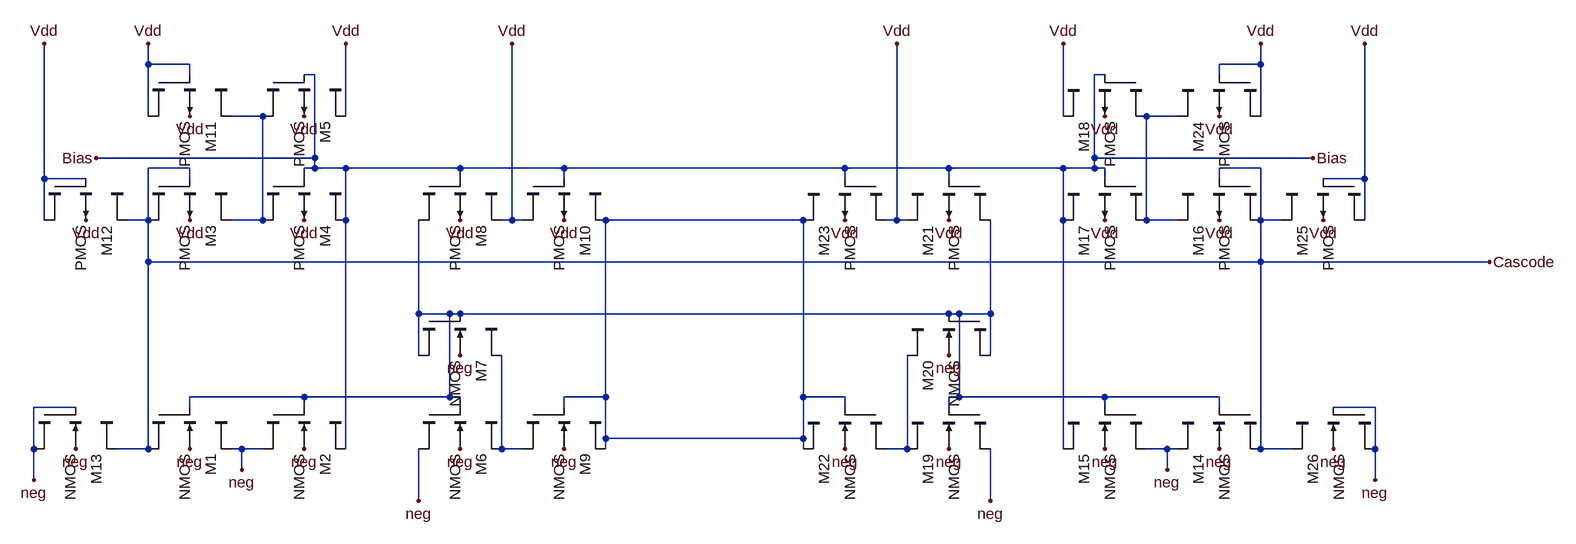
[diagram p0: schematic doublebiasLVS.asc]
doublebiasLVS.asc, the LTspice schematic file:
Version 4
SHEET 1 2224 680
WIRE 32 -272 32 -304
WIRE 96 -272 32 -272
WIRE 1744 -272 1744 -304
WIRE 1744 -272 1680 -272
WIRE 96 -256 96 -272
WIRE 288 -256 272 -256
WIRE 1504 -256 1488 -256
WIRE 1680 -256 1680 -272
WIRE 32 -192 32 -272
WIRE 208 -192 160 -192
WIRE 336 -192 336 -304
WIRE 1440 -192 1440 -304
WIRE 1616 -192 1568 -192
WIRE 1744 -192 1744 -272
WIRE 288 -128 288 -256
WIRE 288 -128 -48 -128
WIRE 1488 -128 1488 -256
WIRE 1824 -128 1488 -128
WIRE 96 -112 32 -112
WIRE 288 -112 288 -128
WIRE 288 -112 272 -112
WIRE 336 -112 288 -112
WIRE 512 -112 336 -112
WIRE 672 -112 512 -112
WIRE 1104 -112 672 -112
WIRE 1264 -112 1104 -112
WIRE 1440 -112 1264 -112
WIRE 1488 -112 1488 -128
WIRE 1488 -112 1440 -112
WIRE 1504 -112 1488 -112
WIRE 1744 -112 1680 -112
WIRE -128 -96 -128 -304
WIRE -64 -96 -128 -96
WIRE 96 -96 96 -112
WIRE 272 -96 272 -112
WIRE 512 -96 512 -112
WIRE 672 -96 672 -112
WIRE 1104 -96 1104 -112
WIRE 1264 -96 1264 -112
WIRE 1504 -96 1504 -112
WIRE 1680 -96 1680 -112
WIRE 1904 -96 1904 -304
WIRE 1904 -96 1840 -96
WIRE -128 -32 -128 -96
WIRE 32 -32 32 -112
WIRE 32 -32 0 -32
WIRE 208 -32 208 -192
WIRE 208 -32 160 -32
WIRE 336 -32 336 -112
WIRE 592 -32 592 -304
WIRE 592 -32 576 -32
WIRE 608 -32 592 -32
WIRE 1040 -32 736 -32
WIRE 1184 -32 1184 -304
WIRE 1184 -32 1168 -32
WIRE 1200 -32 1184 -32
WIRE 1440 -32 1440 -112
WIRE 1568 -32 1568 -192
WIRE 1616 -32 1568 -32
WIRE 1744 -32 1744 -112
WIRE 1776 -32 1744 -32
WIRE 1904 -32 1904 -96
WIRE 32 32 32 -32
WIRE 1744 32 1744 -32
WIRE 1744 32 32 32
WIRE 2096 32 1744 32
WIRE 448 112 448 -32
WIRE 496 112 448 112
WIRE 512 112 496 112
WIRE 1264 112 512 112
WIRE 1280 112 1264 112
WIRE 1328 112 1328 -32
WIRE 1328 112 1280 112
WIRE 448 176 448 112
WIRE 1328 176 1328 112
WIRE 272 240 96 240
WIRE 496 240 496 112
WIRE 496 240 272 240
WIRE 512 240 496 240
WIRE 736 240 736 -32
WIRE 736 240 672 240
WIRE 1040 240 1040 -32
WIRE 1104 240 1040 240
WIRE 1280 240 1280 112
WIRE 1280 240 1264 240
WIRE 1504 240 1280 240
WIRE 1680 240 1504 240
WIRE -80 256 -144 256
WIRE 96 256 96 240
WIRE 272 256 272 240
WIRE 512 256 512 240
WIRE 672 256 672 240
WIRE 1104 256 1104 240
WIRE 1264 256 1264 240
WIRE 1504 256 1504 240
WIRE 1680 256 1680 240
WIRE 1920 256 1856 256
WIRE 736 304 736 240
WIRE 1040 304 1040 240
WIRE 1040 304 736 304
WIRE -144 320 -144 256
WIRE 32 320 32 32
WIRE 32 320 -16 320
WIRE 176 320 160 320
WIRE 208 320 176 320
WIRE 336 320 336 -32
WIRE 576 320 576 176
WIRE 608 320 576 320
WIRE 736 320 736 304
WIRE 1040 320 1040 304
WIRE 1200 320 1200 176
WIRE 1200 320 1168 320
WIRE 1440 320 1440 -32
WIRE 1600 320 1568 320
WIRE 1616 320 1600 320
WIRE 1744 320 1744 32
WIRE 1792 320 1744 320
WIRE 1920 320 1920 256
WIRE 176 352 176 320
WIRE 1600 352 1600 320
WIRE -144 368 -144 320
WIRE 1920 368 1920 320
WIRE 448 400 448 320
WIRE 1328 400 1328 320
FLAG 96 -32 Vdd
FLAG 272 -32 Vdd
FLAG 272 -192 Vdd
FLAG 336 -304 Vdd
FLAG 512 -32 Vdd
FLAG 672 -32 Vdd
FLAG 592 -304 Vdd
FLAG -48 -128 Bias
FLAG 96 -192 Vdd
FLAG 32 -304 Vdd
FLAG -128 -304 Vdd
FLAG -64 -32 Vdd
FLAG 1680 -32 Vdd
FLAG 1504 -32 Vdd
FLAG 1504 -192 Vdd
FLAG 1440 -304 Vdd
FLAG 1264 -32 Vdd
FLAG 1104 -32 Vdd
FLAG 1184 -304 Vdd
FLAG 1824 -128 Bias
FLAG 1680 -192 Vdd
FLAG 1744 -304 Vdd
FLAG 1904 -304 Vdd
FLAG 1840 -32 Vdd
FLAG 2096 32 Cascode
FLAG 1920 368 neg
FLAG 1856 320 neg
FLAG 1680 320 neg
FLAG 1600 352 neg
FLAG 1504 320 neg
FLAG 1328 400 neg
FLAG 1264 320 neg
FLAG 1104 320 neg
FLAG 672 320 neg
FLAG 512 320 neg
FLAG 448 400 neg
FLAG 272 320 neg
FLAG 176 352 neg
FLAG 96 320 neg
FLAG -80 320 neg
FLAG -144 368 neg
FLAG 512 176 neg
FLAG 1264 176 neg
SYMBOL cktsym\\nmos4 96 320 R90
SYMATTR InstName M1
SYMATTR Value2 l=3.9u w=2.1u
SYMBOL cktsym\\nmos4 272 320 R90
SYMATTR InstName M2
SYMATTR Value2 l=8.1u w=.9u
SYMBOL cktsym\\pmos4 96 -32 R90
SYMATTR InstName M3
SYMATTR Value2 l=3.9u w=8.1u
SYMBOL cktsym\\pmos4 272 -32 R90
SYMATTR InstName M4
SYMATTR Value2 l=.9u w=8.1u
SYMBOL cktsym\\pmos4 272 -192 R90
SYMATTR InstName M5
SYMATTR Value2 l=3.9u w=8.1u
SYMBOL cktsym\\nmos4 512 320 R90
SYMATTR InstName M6
SYMATTR Value2 l=3.9u w=2.1u
SYMBOL cktsym\\nmos4 512 176 R90
SYMATTR InstName M7
SYMATTR Value2 l=3.9u w=8.1u
SYMBOL cktsym\\pmos4 512 -32 R90
SYMATTR InstName M8
SYMATTR Value2 l=3.9u w=1.8u
SYMBOL cktsym\\nmos4 672 320 R90
SYMATTR InstName M9
SYMATTR Value2 l=3.9u w=2.1u
SYMBOL cktsym\\pmos4 672 -32 R90
SYMATTR InstName M10
SYMATTR Value2 l=3.9u w=8.1u
SYMBOL cktsym\\pmos4 96 -192 R90
SYMATTR InstName M11
SYMATTR Value2 l=3.9u w=8.1u
SYMBOL cktsym\\pmos4 -64 -32 R90
SYMATTR InstName M12
SYMATTR Value2 l=3.9u w=8.1u
SYMBOL cktsym\\nmos4 -80 320 R90
SYMATTR InstName M13
SYMATTR Value2 l=3.9u w=2.1u
SYMBOL cktsym\\nmos4 1680 320 M90
SYMATTR InstName M14
SYMATTR Value2 l=3.9u w=2.1u
SYMBOL cktsym\\nmos4 1504 320 M90
SYMATTR InstName M15
SYMATTR Value2 l=8.1u w=.9u
SYMBOL cktsym\\pmos4 1680 -32 M90
SYMATTR InstName M16
SYMATTR Value2 l=3.9u w=8.1u
SYMBOL cktsym\\pmos4 1504 -32 M90
SYMATTR InstName M17
SYMATTR Value2 l=.9u w=8.1u
SYMBOL cktsym\\pmos4 1504 -192 M90
SYMATTR InstName M18
SYMATTR Value2 l=3.9u w=8.1u
SYMBOL cktsym\\nmos4 1264 320 M90
SYMATTR InstName M19
SYMATTR Value2 l=3.9u w=2.1u
SYMBOL cktsym\\nmos4 1264 176 M90
SYMATTR InstName M20
SYMATTR Value2 l=3.9u w=8.1u
SYMBOL cktsym\\pmos4 1264 -32 M90
SYMATTR InstName M21
SYMATTR Value2 l=3.9u w=1.8u
SYMBOL cktsym\\nmos4 1104 320 M90
SYMATTR InstName M22
SYMATTR Value2 l=3.9u w=2.1u
SYMBOL cktsym\\pmos4 1104 -32 M90
SYMATTR InstName M23
SYMATTR Value2 l=3.9u w=8.1u
SYMBOL cktsym\\pmos4 1680 -192 M90
SYMATTR InstName M24
SYMATTR Value2 l=3.9u w=8.1u
SYMBOL cktsym\\pmos4 1840 -32 M90
SYMATTR InstName M25
SYMATTR Value2 l=3.9u w=8.1u
SYMBOL cktsym\\nmos4 1856 320 M90
SYMATTR InstName M26
SYMATTR Value2 l=3.9u w=2.1u

The netlist it stands for:
* doublebiasLVS.asc
M1 neg N004 Cascode neg NMOS l=3.9u w=2.1u
M2 Bias N004 neg neg NMOS l=8.1u w=.9u
M3 Cascode Cascode N001 Vdd PMOS l=3.9u w=8.1u
M4 N001 Bias Bias Vdd PMOS l=.9u w=8.1u
M5 N001 Bias Vdd Vdd PMOS l=3.9u w=8.1u
M6 N005 N004 neg neg NMOS l=3.9u w=2.1u
M7 N005 N004 N004 neg NMOS l=3.9u w=8.1u
M8 N004 Bias Vdd Vdd PMOS l=3.9u w=1.8u
M9 N003 N003 N005 neg NMOS l=3.9u w=2.1u
M10 Vdd Bias N003 Vdd PMOS l=3.9u w=8.1u
M11 Vdd Vdd N001 Vdd PMOS l=3.9u w=8.1u
M12 Vdd Vdd Cascode Vdd PMOS l=3.9u w=8.1u
M13 Cascode neg neg neg NMOS l=3.9u w=2.1u
M14 neg N004 Cascode neg NMOS l=3.9u w=2.1u
M15 Bias N004 neg neg NMOS l=8.1u w=.9u
M16 Cascode Cascode N002 Vdd PMOS l=3.9u w=8.1u
M17 N002 Bias Bias Vdd PMOS l=.9u w=8.1u
M18 N002 Bias Vdd Vdd PMOS l=3.9u w=8.1u
M19 N006 N004 neg neg NMOS l=3.9u w=2.1u
M20 N006 N004 N004 neg NMOS l=3.9u w=8.1u
M21 N004 Bias Vdd Vdd PMOS l=3.9u w=1.8u
M22 N003 N003 N006 neg NMOS l=3.9u w=2.1u
M23 Vdd Bias N003 Vdd PMOS l=3.9u w=8.1u
M24 Vdd Vdd N002 Vdd PMOS l=3.9u w=8.1u
M25 Vdd Vdd Cascode Vdd PMOS l=3.9u w=8.1u
M26 Cascode neg neg neg NMOS l=3.9u w=2.1u
.model NMOS NMOS
.model PMOS PMOS
.lib standard.mos
.backanno
.end